# EasyEDA schematic zhou ASCII.SchDoc_2021-06-06.json
TITLE: Sheet_1; REV: 1.0; Date: 2021-06-03; Sheet: 1/1; Drawn By: Zzx2021; Company: Your Company
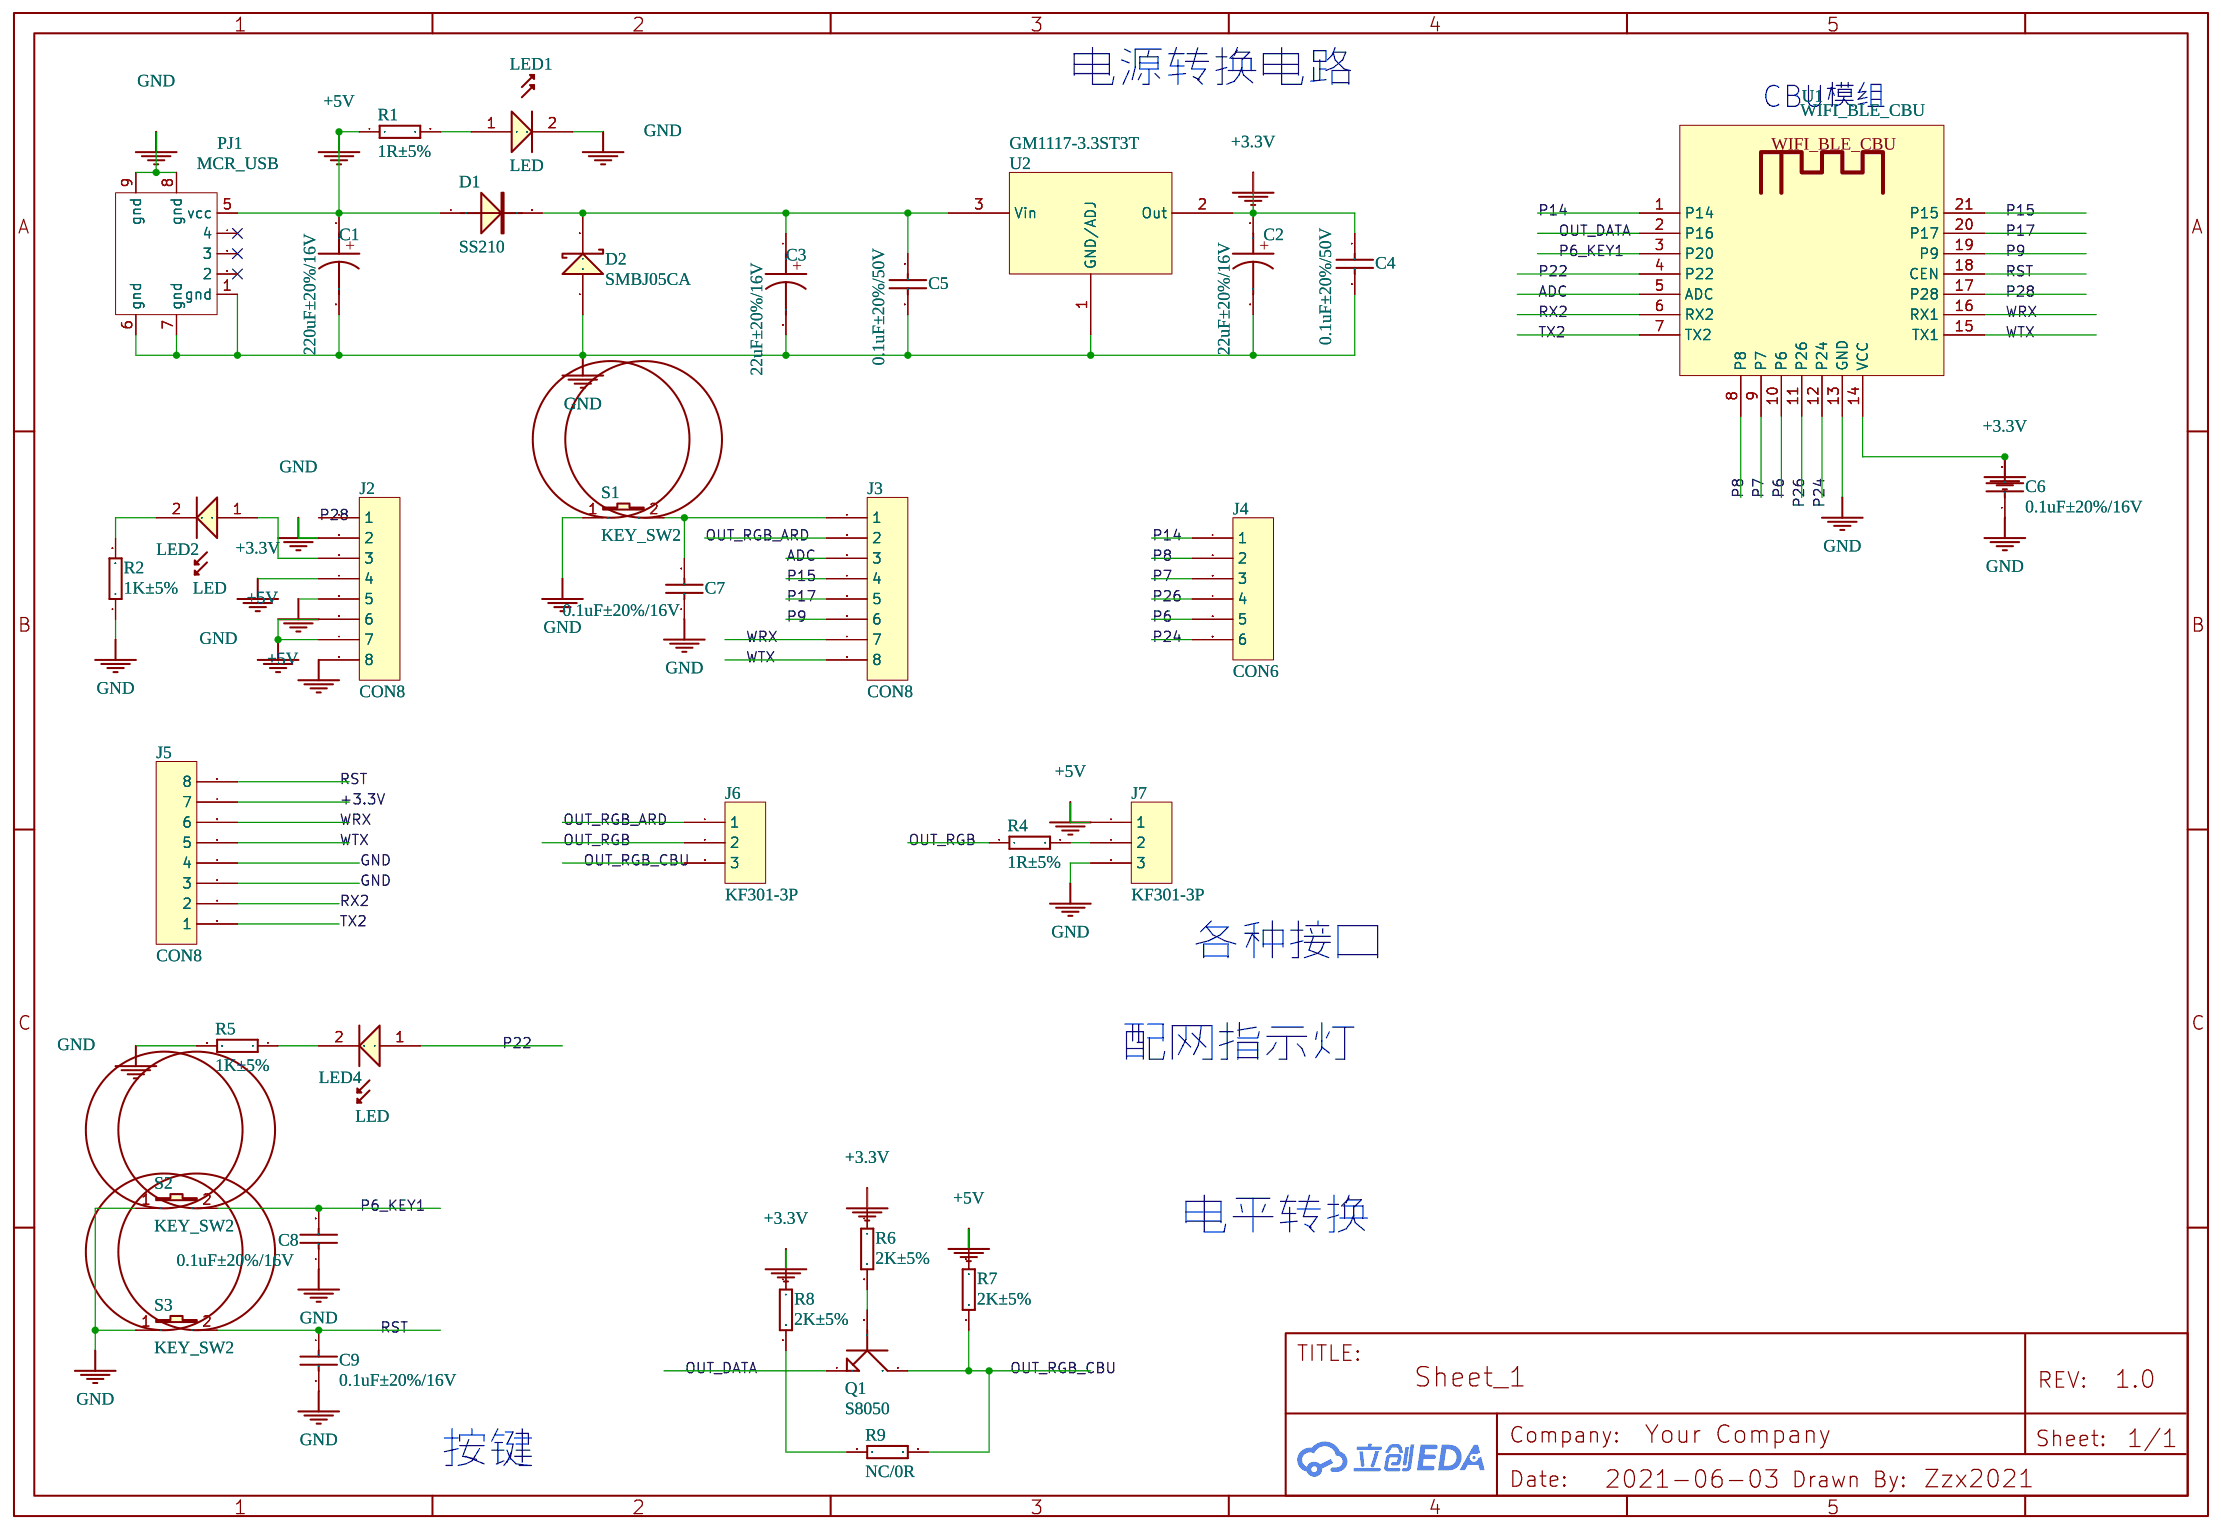
[diagram p0: schematic sheet]

## Parts
C1  220uF±20%/16V  [CD0.15]
C2  22uF±20%/16V  [C0603]
C3  22uF±20%/16V  [C0603]
C4  0.1uF±20%/50V  [C0603]
C5  0.1uF±20%/50V  [C0603]
C6  0.1uF±20%/16V  [C0603]
C7  0.1uF±20%/16V  [C0603]
C8  0.1uF±20%/16V  [C0603]
C9  0.1uF±20%/16V  [C0603]
D1  SS210  [SMA(DO-214AC)]
D2  SMBJ05CA  [SMB(DO-214AA)]
J2  CON8  [HDR1X8Z]
J3  CON8  [HDR1X8Z]
J4  CON6  [HDR1X6Z]
J5  CON8  [HDR1X8Z]
J6  KF301-3P  [SIP3 - 2.54]
J7  KF301-3P  [SIP3 - 2.54]
LED1  LED  [LED0805_1]
LED2  LED  [LED0805_1]
LED4  LED  [LED0805_1]
PJ1  MCR_USB  [MICRO_USB-NEW-16.12.12]
Q1  S8050  [SOT-23-NPN]
R1  1R±5%  [R0603]
R2  1K±5%  [R0603]
R4  1R±5%  [R0603]
R5  1K±5%  [R0603]
R6  2K±5%  [R0603]
R7  2K±5%  [R0603]
R8  2K±5%  [R0603]
R9  NC/0R  [R0603]
S1  KEY_SW2  [KEY4-SMD]
S2  KEY_SW2  [KEY4-SMD]
S3  KEY_SW2  [KEY4-SMD]
U1  WIFI_BLE_CBU  [WIFI_BLE_CBU]
U2  GM1117-3.3ST3T  [SOT-223]

## Library data of the parts
D2 = -: MFR: Toshiba
LED1 LED2 LED4 = -: Published: *; LatestRevisionDate: *; LatestRevisionNote: *; DatasheetDocument: *; PackageDocument: *; PackageReference: *; Publisher: *; ComponentLink1Description: *; ComponentLink1URL: *; Code_JEDEC: *
PJ1 = -: Published: *; Revision 1: *; Revision 2: *; Datasheet: *; Publisher: *

## Nets
+3.3V: C2.1 C4.1 C6.2 J2.4 J5.7 R6.1 R8.1 U1.14(VCC) U2.2(Out)
+5V: C1.1 D1.1 J2.5 J2.8 J7.1 PJ1.5(vcc) R1.1 R7.1
GND: C1.2 C2.2 C3.2 C4.2 C5.2 C6.1 C7.1 C8.1 C9.2 D2.1(A) J2.2 J2.6 J2.7 J5.3 J5.4 J7.3 LED1.2 PJ1.1(gnd) PJ1.6(gnd) PJ1.7(gnd) PJ1.8(gnd) PJ1.9(gnd) R2.1 R5.2 S1.1 S2.1 S3.1 U1.13(GND) U2.1(GND/ADJ)
ADC: J3.3 U1.5(ADC)
OUT_DATA: Q1.1(E) R8.2 R9.1 U1.2(P16)
OUT_RGB: J6.2 R4.1
OUT_RGB_ARD: J3.2 J6.1
OUT_RGB_CBU: J6.3 Q1.3(C) R7.2 R9.2
P6: J4.5 U1.10(P6)
P6_KEY1: C8.2 S2.2 U1.3(P20)
P7: J4.3 U1.9(P7)
P8: J4.2 U1.8(P8)
P9: J3.6 U1.19(P9)
P14: J4.1 U1.1(P14)
P15: J3.4 U1.21(P15)
P17: J3.5 U1.20(P17)
P22: LED4.1 U1.4(P22)
P24: J4.6 U1.12(P24)
P26: J4.4 U1.11(P26)
P28: J2.1 U1.17(P28)
RST: C9.1 J5.8 S3.2 U1.18(CEN)
RX2: J5.2 U1.6(RX2)
TX2: J5.1 U1.7(TX2)
WRX: J3.7 J5.6 U1.16(RX1)
WTX: J3.8 J5.5 U1.15(TX1)
Net-(C3-1): C3.1 C5.1 D1.2 D2.2(K) U2.3(Vin)
Net-(C7-2): C7.2 J3.1 S1.2
Net-(J2-3): J2.3 LED2.1
Net-(J7-2): J7.2 R4.2
Net-(LED1-1): LED1.1 R1.2
Net-(LED2-2): LED2.2 R2.2
Net-(LED4-2): LED4.2 R5.1
Net-(Q1-2): Q1.2(B) R6.2

Not connected (* = marked no-connect by the designer): PJ1 2* 3* 4*

## Notes on the sheet
- 电源转换电路
- CBU模组
- 各种接口
- 配网指示灯
- 电平转换
- 按键
